# EAGLE design Board (EAGLE 8.0.0)
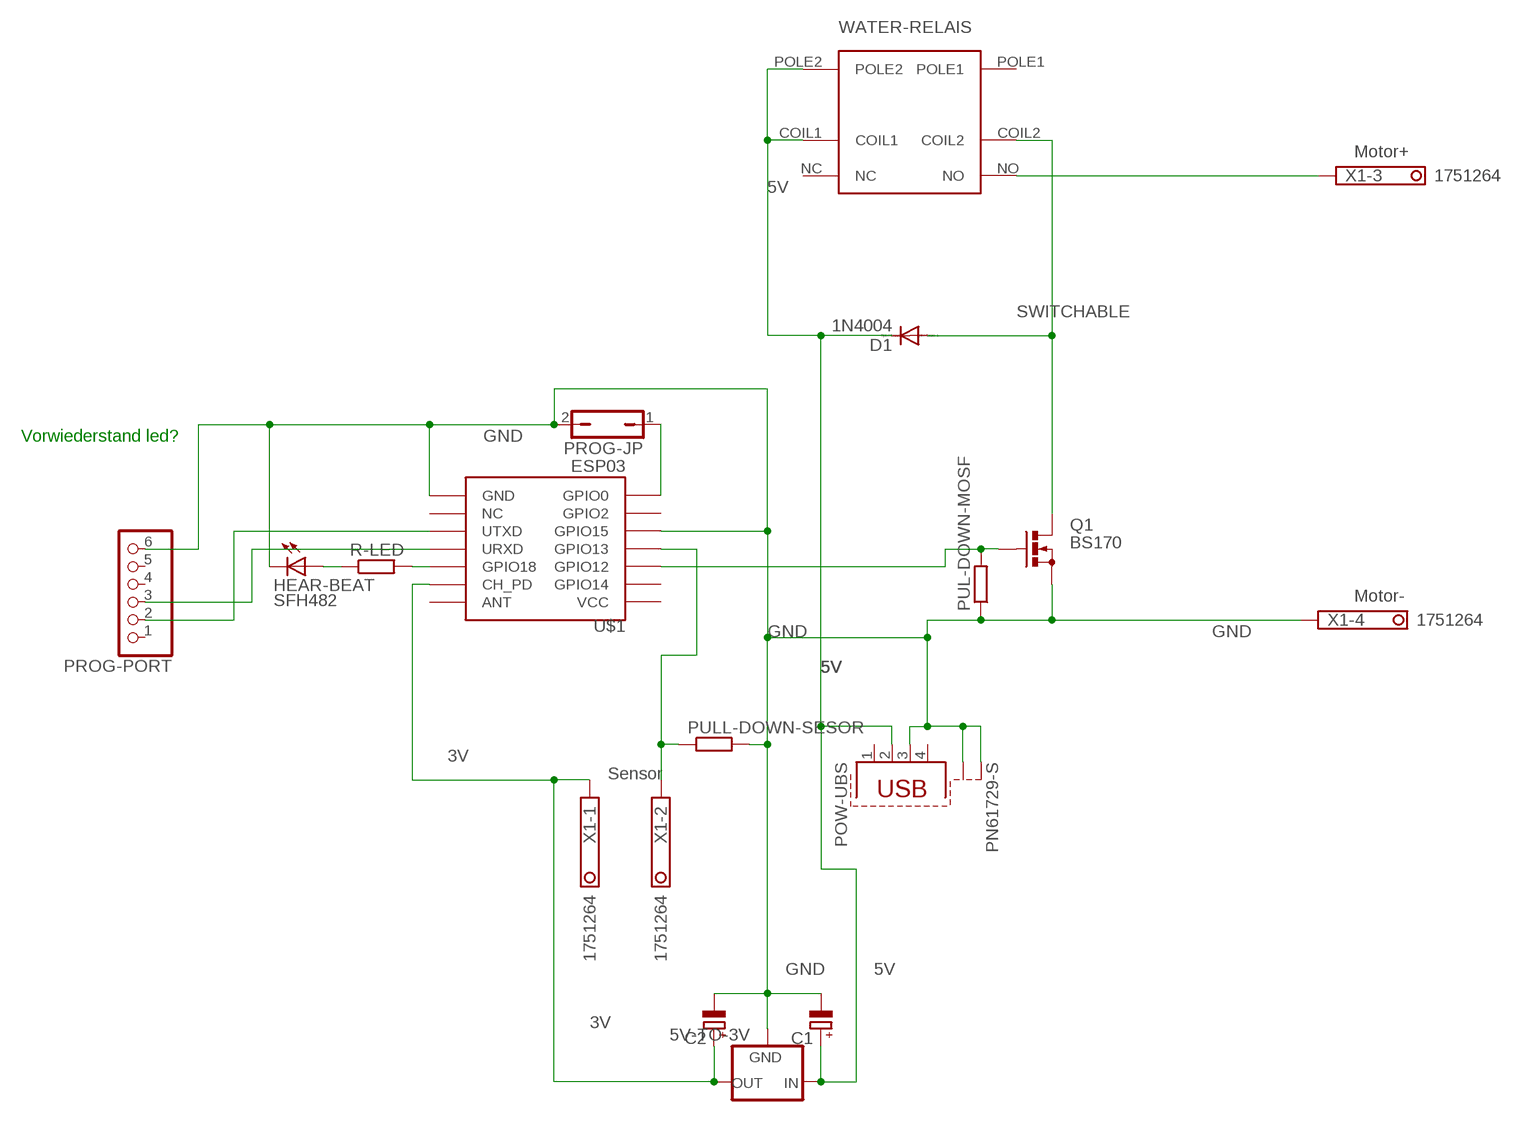
[diagram p0: schematic, sheet 1]

## Parts
5V-TO-3V  78XXL  [78XXL]
C1  CPOL-EUE2.5-6  [E2,5-6]
C2  CPOL-EUE2.5-6  [E2,5-6]
D1  1N4004  [DO41-10]
HEAR-BEAT  SFH482  [SFH482]
POW-UBS  PN61729-S  [PN61729-S]
PROG-JP  JP1Q  [JP1]
PROG-PORT  PINHD-1X6  [1X06]
PUL-DOWN-MOSF  R-EU_0207/10  [0207/10]
PULL-DOWN-SESOR  R-EU_0207/10  [0207/10]
Q1  BS170  [SOT54E]
R-LED  R-EU_0207/10  [0207/10]
U$1  ESP03  [ESP03]
WATER-RELAIS  HJR-4102-L-C  [HJR-4102-L]
X1  1751264  [1751264]

## Nets
3V: 5V-TO-3V.OUT C2.+ U$1.CH_PD X1.1
5V: 5V-TO-3V.IN C1.+ D1.C POW-UBS.2 WATER-RELAIS.COIL1 WATER-RELAIS.POLE2
GND: 5V-TO-3V.GND C1.- C2.- HEAR-BEAT.K(C) POW-UBS.3 POW-UBS.S1 POW-UBS.S2 PROG-JP.2 PROG-PORT.6 PUL-DOWN-MOSF.1 PULL-DOWN-SESOR.2 Q1.S U$1.GND U$1.GPIO15 X1.4
N$1: PUL-DOWN-MOSF.2 Q1.G U$1.GPIO12
N$2: PROG-PORT.3 U$1.URXD
N$3: HEAR-BEAT.A R-LED.1
N$4: WATER-RELAIS.NO X1.3
N$5: PROG-PORT.2 U$1.UTXD
N$6: R-LED.2 U$1.GPIO18
N$8: PROG-JP.1 U$1.GPIO0
N$9: PULL-DOWN-SESOR.1 U$1.GPIO13 X1.2
SWITCHABLE: D1.A Q1.D WATER-RELAIS.COIL2
Unconnected: POW-UBS.1 POW-UBS.4 PROG-PORT.1 PROG-PORT.4 PROG-PORT.5 U$1.ANT U$1.GPIO2 U$1.GPIO14 U$1.NC U$1.VCC WATER-RELAIS.NC WATER-RELAIS.POLE1

## Notes on the sheet
- Motor+
- Vorwiederstand led?
- Motor-
- Sensor

## Library data of the parts
5V-TO-3V = v-reg:78XXL: VOLTAGE REGULATOR
C1 C2 = rcl:CPOL-EU: POLARIZED CAPACITOR, European symbol
D1 = diode:1N4004: DIODE general purpose rectifier, 1 A
HEAR-BEAT = led:SFH482: IR LED infrared emitting diode, Infineon
POW-UBS = con-berg:PN61729-S: BERG USB connector; OC_FARNELL: unknown; OC_NEWARK: unknown
PROG-JP = jumper:JP1Q: JUMPER
PROG-PORT = pinhead:PINHD-1X6: PIN HEADER
PUL-DOWN-MOSF PULL-DOWN-SESOR R-LED = resistor:R-EU_: RESISTOR, European symbol
Q1 = transistor-small-signal:BS170: N-CHANNEL MOS FET
U$1 = esp8266modules:ESP03: ESP8266 Wifi module 03; DIMENSIONS: 17.3 x 12.1 mm; PINS: 14; PITCH: 0.078" / 2 mm
WATER-RELAIS = HJR-4102-L-C:HJR-4102-L-C
X1 = con-phoenix-350:1751264: MKDS 1/ 4-3,5 Printklemme Nennstrom: 10 A Bemessungsspannung: 160 V Raster: 3,5 mm Polzahl: 4 Montageart: Löten Anschlussart: Schraubanschluss Anschlussrichtung vom Leiter zur Platine: 0° Source: http://eshop.phoenixcontact.com .. 1751264.pdf; MPN: 1751264; OC_FARNELL: unknown; OC_NEWARK: 10R0934

## Board
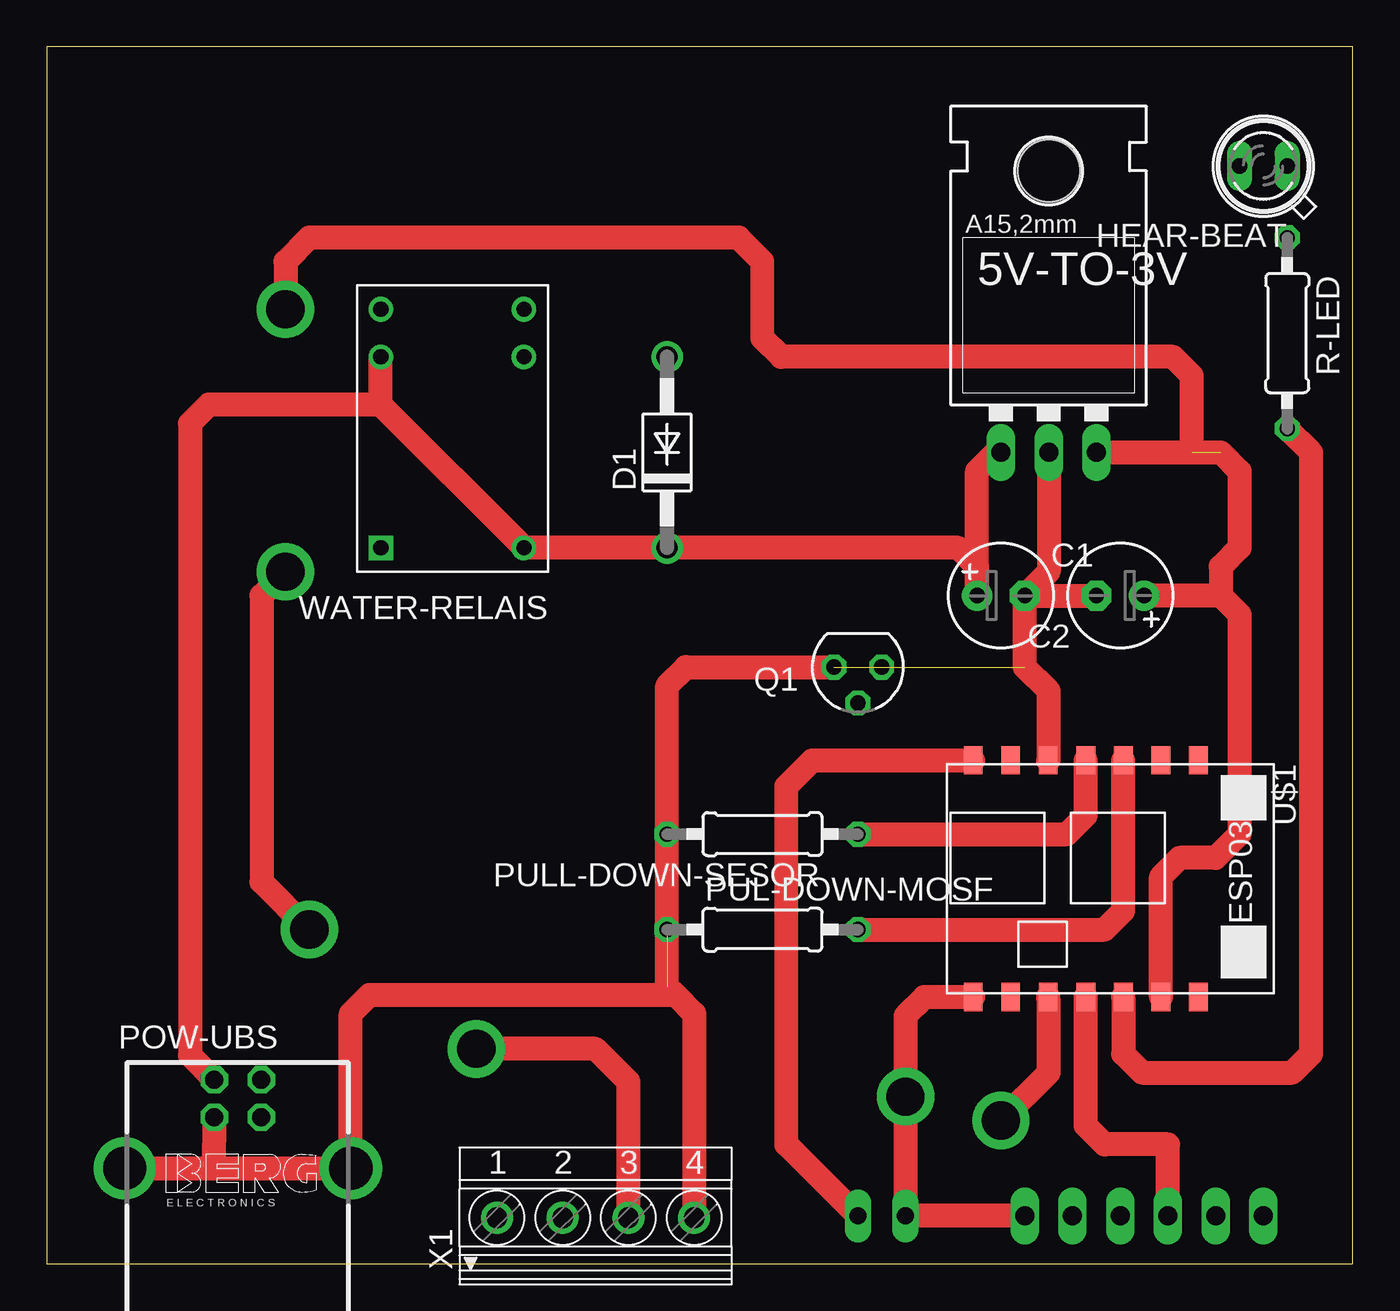
[diagram p1: board, top side]
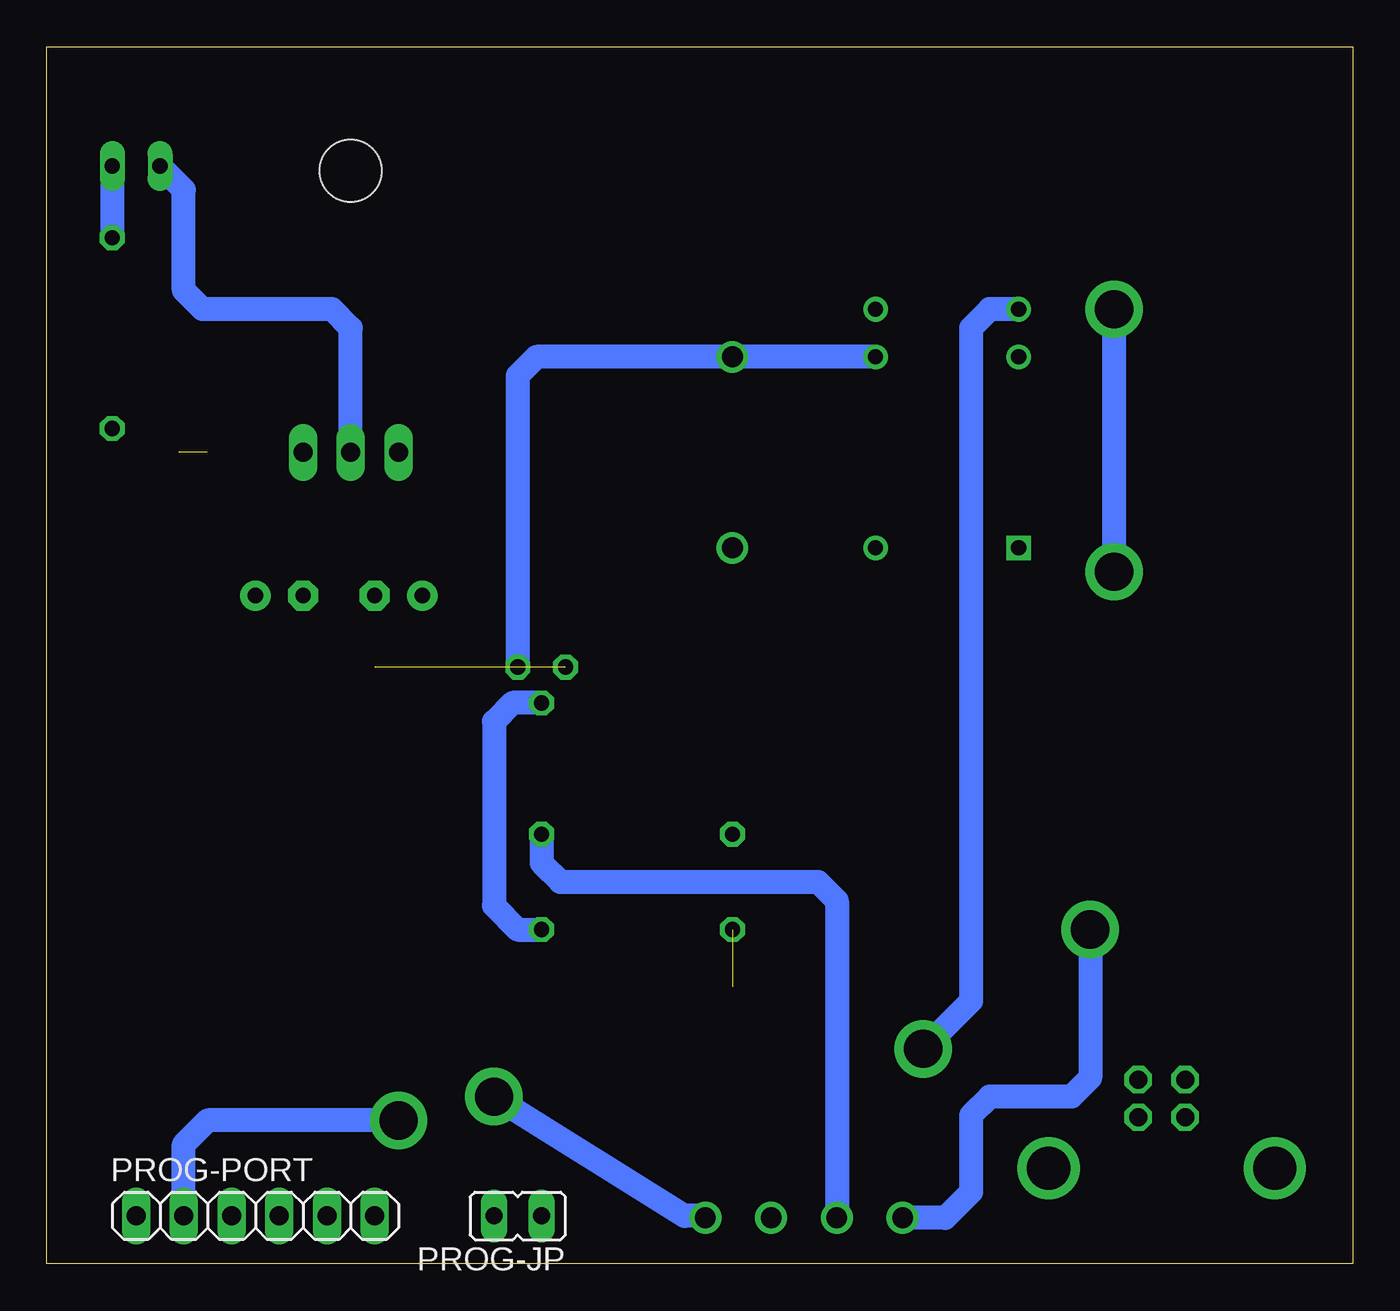
[diagram p2: board, bottom side, seen from below]

Size 69.52 x 64.76 mm. Coordinates in mm from the lower left corner, seen from the top.
Outline: 0,0 69.52,0 69.52,64.76 0,64.76 0,0
Copper layers (1*16): Top 0.035mm / dielectric 1.5mm / Bottom 0.035mm
Design rules "default": minimum track width 10mil, minimum drill 24mil, track to track 8mil, track to pad 8mil, pad to pad 8mil, via to via 8mil, smd to smd 8mil, copper to edge 40mil, drill to drill 8mil, minimum pad ring 10mil, minimum via ring 8mil, stop-mask expansion 4mil, vias tented up to drill 0mil, thermal gap 10mil

### Footprints (pad centres in the part's own frame; a part is rotated, then mirrored left to right if it is on the bottom)
78XXL = drill 1.016 long: GND 0,-3.81; IN -2.54,-3.81; OUT 2.54,-3.81 | hole 3.302: 0,11.176
E2,5-6 = drill 0.813 pad 1.6: + -1.27,0 | drill 0.813 pad 1.6 octagon: - 1.27,0
DO41-10 = drill 1.118: A 5.08,0; C -5.08,0
SFH482 = drill 0.813 long: A -1.27,0; K 1.27,0
PN61729-S = drill 0.95 octagon: 1 1.25,4.71; 2 -1.25,4.71; 3 -1.25,2.71; 4 1.25,2.71 | drill 2.3 pad 2.9: S1 -6.02,0; S2 6.02,0
JP1 = drill 0.914 long: 1 0,-1.27; 2 0,1.27
1X06 = drill 1.016 long: 1 -6.35,0; 2 -3.81,0; 3 -1.27,0; 4 1.27,0; 5 3.81,0; 6 6.35,0
0207/10 = drill 0.813 octagon: 1 -5.08,0; 2 5.08,0
SOT54E = drill 0.813 octagon: D -1.27,0; G 0,1.905; S 1.27,0
ESP03 = smd 1.5 x 1: ANT 7.4,4.8; CH_PD 7.4,2.8; GND 7.4,-7.2; GPIO0 -5.2,-7.2; GPIO2 -5.2,-5.2; GPIO12 -5.2,0.8; GPIO13 -5.2,-1.2; GPIO14 -5.2,2.8; GPIO15 -5.2,-3.2; GPIO18 7.4,0.8; NC 7.4,-5.2; URXD 7.4,-1.2; UTXD 7.4,-3.2; VCC -5.2,4.8
HJR-4102-L = drill 0.8: COIL1 10.16,0; COIL2 10.16,-7.62; NC 12.7,-7.62; NO 12.7,0; POLE2 0,-7.62 | drill 0.8 square: POLE1 0,0
1751264 = drill 1.1 pad 1.7: 1 -5.25,-0.1; 2 -1.75,-0.1; 3 1.75,-0.1; 4 5.25,-0.1

### Placement (x,y rotation side)
5V-TO-3V  53.34,46.99 0 top
C1  50.8,35.56 0 top
C2  57.15,35.56 180 top
D1  33.02,43.18 90 top
HEAR-BEAT  64.77,58.42 180 top
POW-UBS  10.16,5.08 0 top
PROG-JP  44.45,2.54 90 bottom
PROG-PORT  58.42,2.54 0 bottom
PUL-DOWN-MOSF  38.1,17.78 0 top
PULL-DOWN-SESOR  38.1,22.86 180 top
Q1  43.18,31.75 180 top
R-LED  66.04,49.53 270 top
U$1  56.52,21.59 270 top
WATER-RELAIS  17.78,38.1 90 top
X1  29.21,2.54 0 top

### Tracks (layer width: path | path; a pad name or v marks a point on that pad's centre or on a via)
3V  (via drill 2.03)  (1 unrouted)
  Top 1.27: U$1.CH_PD 59.31,20.59 60.31,21.59 62.23,21.59 63.5,22.86 63.5,34.56 62.5,35.56 | 62.5,35.56 C2.+ | 5V-TO-3V.OUT 62.5,43.18 63.5,42.18 63.5,38.1 62.5,37.1 62.5,35.56 | 60.96,43.18 60.96,47.26 59.96,48.26 39.1,48.26 38.1,49.26 38.1,53.34 36.83,54.61 13.97,54.61 12.7,53.34 v12.7,50.8 | v13.97,17.78 11.43,20.32 11.43,35.56 v12.7,36.83
  Bottom 1.27: v12.7,50.8 v12.7,36.83 | 24.13,2.54 X1.1 21.69,2.44 20.32,3.81 20.32,7.89 19.32,8.89 14.97,8.89 13.97,9.89 v13.97,17.78
5V
  Top 1.27: 5V-TO-3V.IN 50.53,43.18 49.53,42.18 C1.+ 49.53,37.1 48.53,38.1 D1.C WATER-RELAIS.POLE2 17.78,45.72 | 17.78,45.72 WATER-RELAIS.COIL1 | POW-UBS.2 7.62,11.08 7.62,44.72 8.62,45.72 17.78,45.72
GND  (via drill 2.03)  (2 unrouted)
  Top 1.27: 8.89,5.08 POW-UBS.S2 16.18,13.3 17.18,14.3 33.46,14.3 | 8.89,5.08 POW-UBS.S1 3.81,5.08 | POW-UBS.3 8.89,5.08 | X1.4 34.46,13.3 33.46,14.3 | C1.- C2.- | 5V-TO-3V.GND 53.34,36.83 C1.- | U$1.GPIO15 53.34,26.82 53.34,30.48 52.07,31.75 C1.- | 33.46,14.3 33.02,14.74 PULL-DOWN-SESOR.2 33.02,30.75 34.02,31.75 Q1.S | PROG-PORT.6 PROG-JP.2 v45.72,8.89 45.72,13.19 46.72,14.19 U$1.GND
  Bottom 1.27: v45.72,8.89 35.56,2.54 34.29,2.54 X1.4 | 5V-TO-3V.GND 53.34,49.8 54.34,50.8 61.23,50.8 62.23,51.8 62.23,57.15 HEAR-BEAT.K
N$1
  Top 1.27: PUL-DOWN-MOSF.2 56.31,17.78 57.31,18.78 U$1.GPIO12
  Bottom 1.27: Q1.G 44.72,29.84 45.72,28.84 45.72,19.05 44.45,17.78 PUL-DOWN-MOSF.2
N$2
  Top 1.27: PROG-PORT.3 59.69,6.35 56.31,6.35 55.31,7.35 U$1.URXD
N$3
  Bottom 1.27: HEAR-BEAT.A R-LED.1
N$4  (via drill 2.03)
  Top 1.27: X1.3 30.96,9.68 29.21,11.43 v22.86,11.43
  Bottom 1.27: v22.86,11.43 20.32,13.97 20.32,49.8 19.32,50.8 WATER-RELAIS.NO
N$5  (via drill 2.03)
  Top 1.27: v50.8,7.62 53.34,10.16 53.34,13.97 U$1.UTXD
  Bottom 1.27: v50.8,7.62 60.96,7.62 62.23,6.35 PROG-PORT.2
N$6
  Top 1.27: U$1.GPIO18 57.31,11.16 58.31,10.16 66.31,10.16 67.31,11.16 67.31,43.18 R-LED.2
N$8
  Top 1.27: PROG-JP.1 39.37,6.35 39.37,25.4 40.76,26.79 U$1.GPIO0
N$9
  Top 1.27: PULL-DOWN-SESOR.1 54.31,22.86 55.31,23.86 U$1.GPIO13
  Bottom 1.27: PULL-DOWN-SESOR.1 43.18,21.32 42.18,20.32 28.46,20.32 27.46,19.32 X1.2
SWITCHABLE
  Bottom 1.27: WATER-RELAIS.COIL2 D1.A 43.45,48.26 44.45,47.26 Q1.D